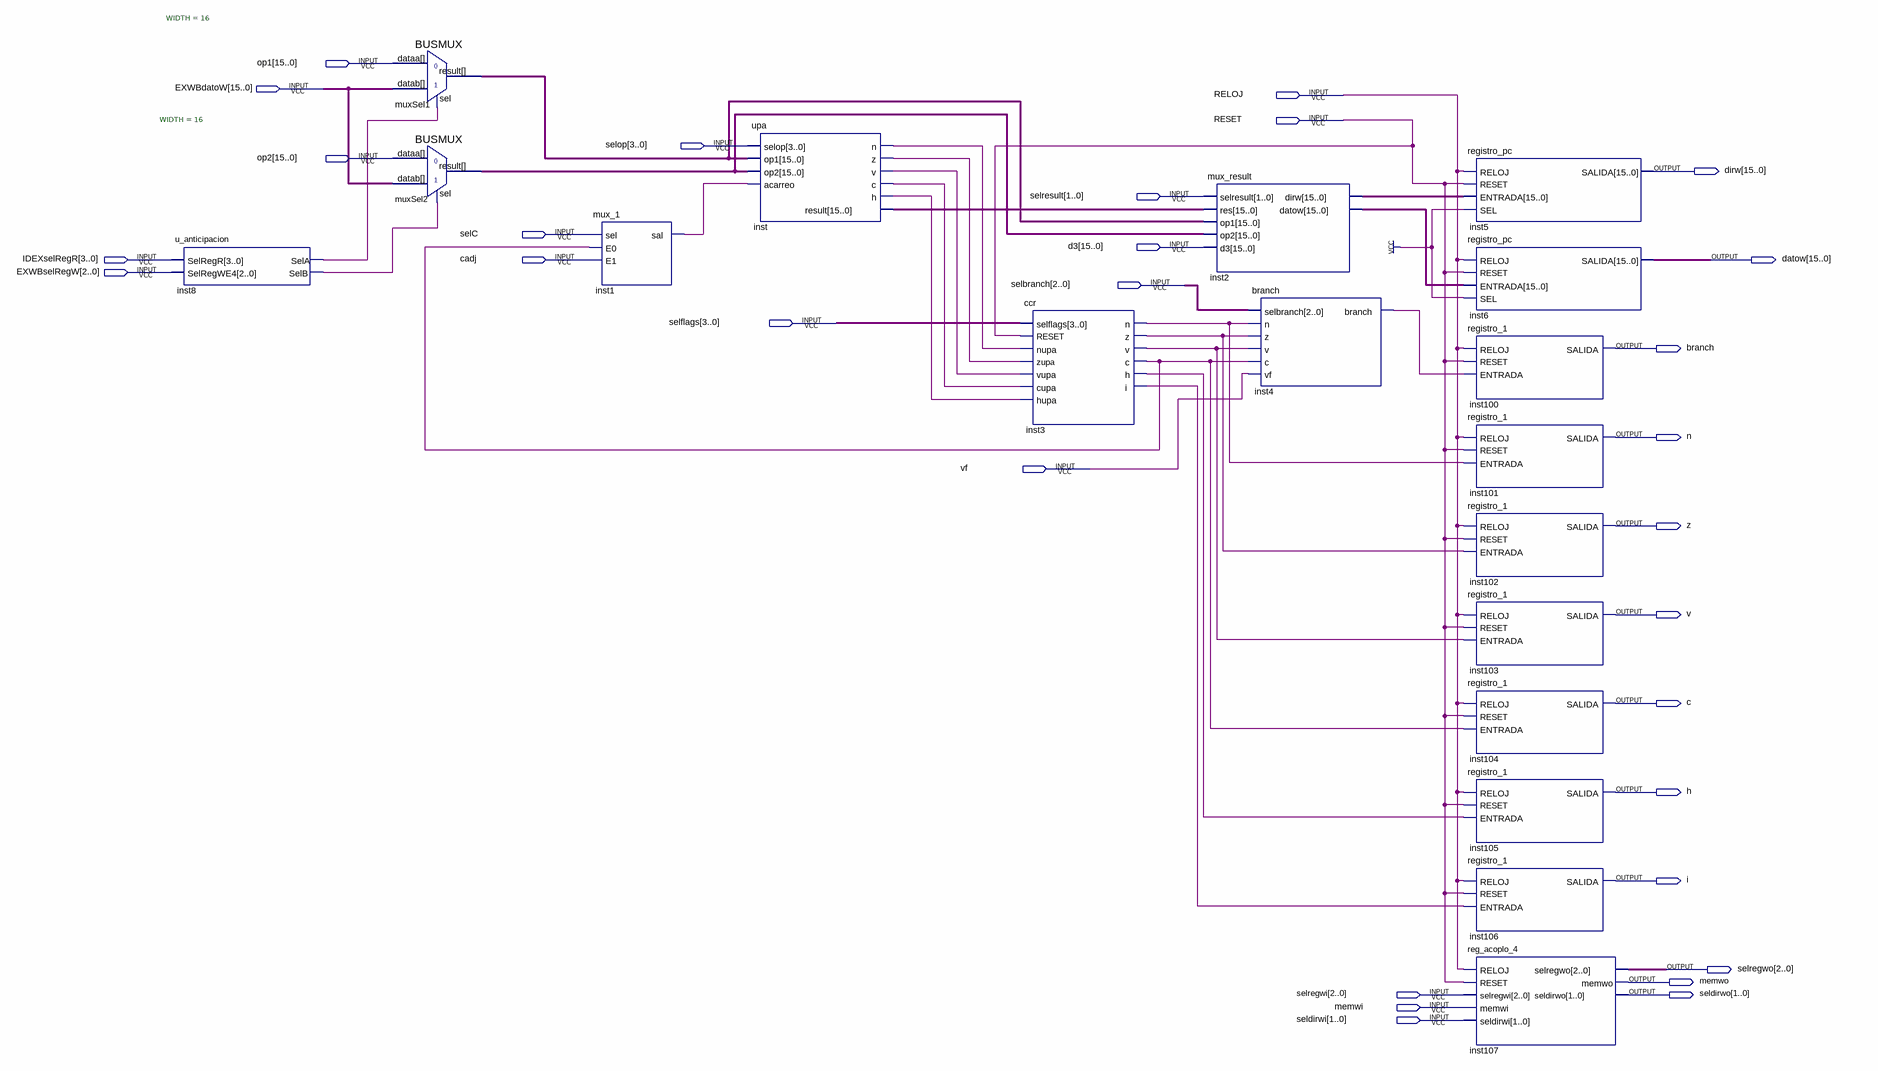
[diagram p0: schematic sheet]
// Quartus schematic etapa3.bdf as structural Verilog: 18 symbols, 30 pins
module etapa3 (
  input  [15:0] op1,
  input  [15:0] EXWBdatoW,
  input  RELOJ,
  input  RESET,
  input  [3:0] selop,
  input  [15:0] op2,
  input  [1:0] selresult,
  input  selC,
  input  [15:0] d3,
  input  [3:0] IDEXselRegR,
  input  cadj,
  input  [2:0] EXWBselRegW,
  input  [2:0] selbranch,
  input  [3:0] selflags,
  input  vf,
  input  [2:0] selregwi,
  input  memwi,
  input  [1:0] seldirwi,
  output [15:0] dirw,
  output [15:0] datow,
  output branch,
  output n,
  output z,
  output v,
  output c,
  output h,
  output i,
  output [2:0] selregwo,
  output memwo,
  output [1:0] seldirwo
);

  wire inst1_sal, inst3_c, inst3_h, inst3_i, inst3_n, inst3_v, inst3_z, inst4_branch, inst8_sela, inst8_selb,
       inst_c, inst_h, inst_n, inst_v, inst_z;
  wire [15:0] inst2_datow, inst2_dirw, inst_result, muxSel1_result, muxSel2_result;

  u_anticipacion inst8 (.SelRegR(IDEXselRegR), .SelRegWE4(EXWBselRegW), .SelA(inst8_sela), .SelB(inst8_selb));
  BUSMUX #(.WIDTH(16)) muxSel1 (.datab(EXWBdatoW), .sel(inst8_sela), .dataa(op1), .result(muxSel1_result));
  BUSMUX #(.WIDTH(16)) muxSel2 (.datab(EXWBdatoW), .sel(inst8_selb), .dataa(op2), .result(muxSel2_result));
  mux_1 inst1 (.sel(selC), .E0(inst3_c), .E1(cadj), .sal(inst1_sal));
  upa inst (
    .selop(selop), .op1(muxSel1_result), .op2(muxSel2_result), .acarreo(inst1_sal), .n(inst_n), .z(inst_z),
    .v(inst_v), .c(inst_c), .h(inst_h), .result(inst_result));
  ccr inst3 (
    .selflags(selflags), .RESET(RESET), .nupa(inst_n), .zupa(inst_z), .vupa(inst_v), .cupa(inst_c),
    .hupa(inst_h), .n(inst3_n), .z(inst3_z), .v(inst3_v), .c(inst3_c), .h(inst3_h), .i(inst3_i));
  mux_result inst2 (
    .selresult(selresult), .res(inst_result), .op1(muxSel1_result), .op2(muxSel2_result), .d3(d3),
    .dirw(inst2_dirw), .datow(inst2_datow));
  branch inst4 (
    .selbranch(selbranch), .n(inst3_n), .z(inst3_z), .v(inst3_v), .c(inst3_c), .vf(vf), .branch(inst4_branch));
  registro_pc inst5 (.RELOJ(RELOJ), .RESET(RESET), .SEL(1'b1), .ENTRADA(inst2_dirw), .SALIDA(dirw));
  registro_pc inst6 (.RELOJ(RELOJ), .RESET(RESET), .SEL(1'b1), .ENTRADA(inst2_datow), .SALIDA(datow));
  registro_1 inst100 (.RELOJ(RELOJ), .RESET(RESET), .ENTRADA(inst4_branch), .SALIDA(branch));
  registro_1 inst101 (.RELOJ(RELOJ), .RESET(RESET), .ENTRADA(inst3_n), .SALIDA(n));
  registro_1 inst102 (.RELOJ(RELOJ), .RESET(RESET), .ENTRADA(inst3_z), .SALIDA(z));
  registro_1 inst103 (.RELOJ(RELOJ), .RESET(RESET), .ENTRADA(inst3_v), .SALIDA(v));
  registro_1 inst104 (.RELOJ(RELOJ), .RESET(RESET), .ENTRADA(inst3_c), .SALIDA(c));
  registro_1 inst105 (.RELOJ(RELOJ), .RESET(RESET), .ENTRADA(inst3_h), .SALIDA(h));
  registro_1 inst106 (.RELOJ(RELOJ), .RESET(RESET), .ENTRADA(inst3_i), .SALIDA(i));
  reg_acoplo_4 inst107 (
    .RELOJ(RELOJ), .RESET(RESET), .selregwi(selregwi), .memwi(memwi), .seldirwi(seldirwi),
    .selregwo(selregwo), .memwo(memwo), .seldirwo(seldirwo));
endmodule
